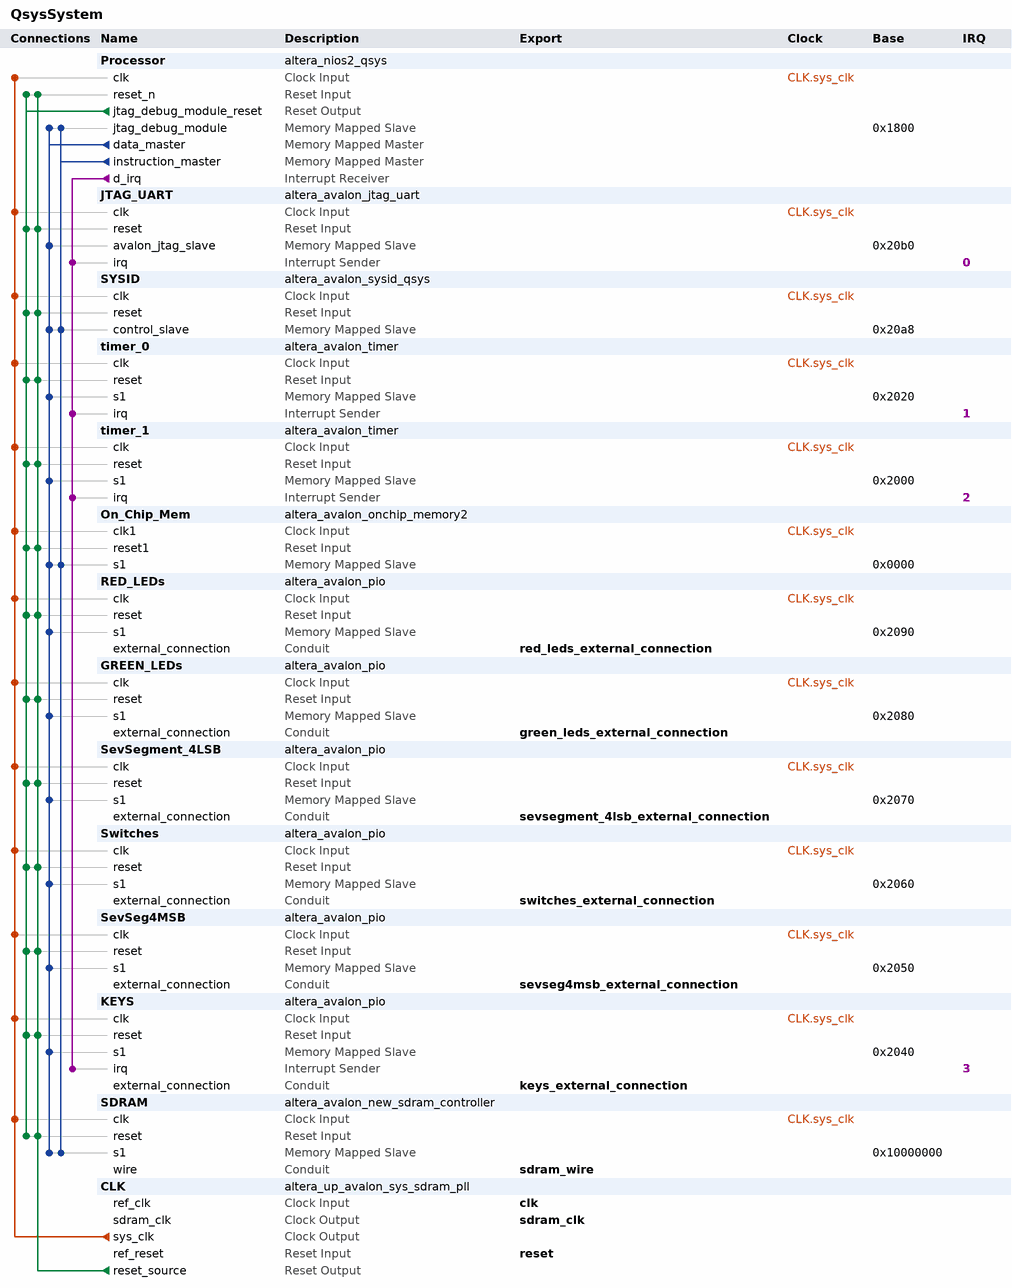
[diagram p0: system contents]
# Platform Designer (Qsys) system QsysSystem, Cyclone IV E EP4CE115F29C7
# Parameters at their usual value, and those the tool derives, are not listed.
package require -exact qsys 16.1
create_system QsysSystem
set_project_property DEVICE_FAMILY {Cyclone IV E}
set_project_property DEVICE EP4CE115F29C7

add_instance Processor altera_nios2_qsys 16.1
set_instance_parameter_value Processor breakSlave Processor.jtag_debug_module
set_instance_parameter_value Processor exceptionSlave SDRAM.s1
set_instance_parameter_value Processor icache_size 4096
set_instance_parameter_value Processor impl Fast
set_instance_parameter_value Processor mmu_TLBMissExcSlave None
set_instance_parameter_value Processor resetSlave SDRAM.s1
set_instance_parameter_value Processor resetrequest_enabled true

add_instance JTAG_UART altera_avalon_jtag_uart 16.1
set_instance_parameter_value JTAG_UART simInteractiveOptions NO_INTERACTIVE_WINDOWS

add_instance SYSID altera_avalon_sysid_qsys 16.1
set_instance_parameter_value SYSID id 0

add_instance timer_0 altera_avalon_timer 16.1
set_instance_parameter_value timer_0 period 1
set_instance_parameter_value timer_0 periodUnits MSEC

add_instance timer_1 altera_avalon_timer 16.1
set_instance_parameter_value timer_1 period 1
set_instance_parameter_value timer_1 periodUnits MSEC

add_instance On_Chip_Mem altera_avalon_onchip_memory2 16.1
set_instance_parameter_value On_Chip_Mem dataWidth 32
set_instance_parameter_value On_Chip_Mem dualPort false
set_instance_parameter_value On_Chip_Mem initMemContent true
set_instance_parameter_value On_Chip_Mem initializationFileName onchip_mem.hex
set_instance_parameter_value On_Chip_Mem memorySize 4096

add_instance RED_LEDs altera_avalon_pio 16.1
set_instance_parameter_value RED_LEDs direction Output
set_instance_parameter_value RED_LEDs width 18

add_instance GREEN_LEDs altera_avalon_pio 16.1
set_instance_parameter_value GREEN_LEDs direction Output
set_instance_parameter_value GREEN_LEDs width 8

add_instance SevSegment_4LSB altera_avalon_pio 16.1
set_instance_parameter_value SevSegment_4LSB direction Output
set_instance_parameter_value SevSegment_4LSB width 32

add_instance Switches altera_avalon_pio 16.1
set_instance_parameter_value Switches direction Input
set_instance_parameter_value Switches width 18

add_instance SevSeg4MSB altera_avalon_pio 16.1
set_instance_parameter_value SevSeg4MSB direction Output
set_instance_parameter_value SevSeg4MSB width 32

add_instance KEYS altera_avalon_pio 16.1
set_instance_parameter_value KEYS captureEdge true
set_instance_parameter_value KEYS direction Input
set_instance_parameter_value KEYS generateIRQ true
set_instance_parameter_value KEYS irqType EDGE
set_instance_parameter_value KEYS width 4

add_instance SDRAM altera_avalon_new_sdram_controller 16.1
set_instance_parameter_value SDRAM TAC 5.4
set_instance_parameter_value SDRAM TRCD 15.0
set_instance_parameter_value SDRAM TRP 15.0
set_instance_parameter_value SDRAM casLatency 3
set_instance_parameter_value SDRAM columnWidth 10
set_instance_parameter_value SDRAM dataWidth 32
set_instance_parameter_value SDRAM generateSimulationModel false
set_instance_parameter_value SDRAM model single_Micron_MT48LC4M32B2_7_chip
set_instance_parameter_value SDRAM numberOfBanks 4
set_instance_parameter_value SDRAM numberOfChipSelects 1
set_instance_parameter_value SDRAM powerUpDelay 100.0
set_instance_parameter_value SDRAM refreshPeriod 7.8125
set_instance_parameter_value SDRAM rowWidth 13

add_instance CLK altera_up_avalon_sys_sdram_pll 16.1
set_instance_parameter_value CLK CV_boards DE1-SoC
set_instance_parameter_value CLK gui_outclk 50.0
set_instance_parameter_value CLK gui_refclk 50.0

# connections
add_connection CLK.sys_clk GREEN_LEDs.clk clock
add_connection CLK.sys_clk JTAG_UART.clk clock
add_connection CLK.sys_clk KEYS.clk clock
add_connection CLK.sys_clk On_Chip_Mem.clk1 clock
add_connection CLK.sys_clk Processor.clk clock
add_connection CLK.sys_clk RED_LEDs.clk clock
add_connection CLK.sys_clk SDRAM.clk clock
add_connection CLK.sys_clk SevSeg4MSB.clk clock
add_connection CLK.sys_clk SevSegment_4LSB.clk clock
add_connection CLK.sys_clk Switches.clk clock
add_connection CLK.sys_clk SYSID.clk clock
add_connection CLK.sys_clk timer_0.clk clock
add_connection CLK.sys_clk timer_1.clk clock
add_connection CLK.reset_source GREEN_LEDs.reset reset
add_connection CLK.reset_source JTAG_UART.reset reset
add_connection CLK.reset_source KEYS.reset reset
add_connection CLK.reset_source On_Chip_Mem.reset1 reset
add_connection CLK.reset_source Processor.reset_n reset
add_connection CLK.reset_source RED_LEDs.reset reset
add_connection CLK.reset_source SDRAM.reset reset
add_connection CLK.reset_source SevSeg4MSB.reset reset
add_connection CLK.reset_source SevSegment_4LSB.reset reset
add_connection CLK.reset_source Switches.reset reset
add_connection CLK.reset_source SYSID.reset reset
add_connection CLK.reset_source timer_0.reset reset
add_connection CLK.reset_source timer_1.reset reset
add_connection Processor.jtag_debug_module_reset GREEN_LEDs.reset reset
add_connection Processor.jtag_debug_module_reset JTAG_UART.reset reset
add_connection Processor.jtag_debug_module_reset KEYS.reset reset
add_connection Processor.jtag_debug_module_reset On_Chip_Mem.reset1 reset
add_connection Processor.jtag_debug_module_reset Processor.reset_n reset
add_connection Processor.jtag_debug_module_reset RED_LEDs.reset reset
add_connection Processor.jtag_debug_module_reset SDRAM.reset reset
add_connection Processor.jtag_debug_module_reset SevSeg4MSB.reset reset
add_connection Processor.jtag_debug_module_reset SevSegment_4LSB.reset reset
add_connection Processor.jtag_debug_module_reset Switches.reset reset
add_connection Processor.jtag_debug_module_reset SYSID.reset reset
add_connection Processor.jtag_debug_module_reset timer_0.reset reset
add_connection Processor.jtag_debug_module_reset timer_1.reset reset
add_connection Processor.data_master GREEN_LEDs.s1 avalon
set_connection_parameter_value Processor.data_master/GREEN_LEDs.s1 baseAddress 0x2080
add_connection Processor.data_master JTAG_UART.avalon_jtag_slave avalon
set_connection_parameter_value Processor.data_master/JTAG_UART.avalon_jtag_slave baseAddress 0x20b0
add_connection Processor.data_master KEYS.s1 avalon
set_connection_parameter_value Processor.data_master/KEYS.s1 baseAddress 0x2040
add_connection Processor.data_master On_Chip_Mem.s1 avalon
set_connection_parameter_value Processor.data_master/On_Chip_Mem.s1 baseAddress 0x0000
add_connection Processor.data_master Processor.jtag_debug_module avalon
set_connection_parameter_value Processor.data_master/Processor.jtag_debug_module baseAddress 0x1800
add_connection Processor.data_master RED_LEDs.s1 avalon
set_connection_parameter_value Processor.data_master/RED_LEDs.s1 baseAddress 0x2090
add_connection Processor.data_master SDRAM.s1 avalon
set_connection_parameter_value Processor.data_master/SDRAM.s1 baseAddress 0x10000000
add_connection Processor.data_master SevSeg4MSB.s1 avalon
set_connection_parameter_value Processor.data_master/SevSeg4MSB.s1 baseAddress 0x2050
add_connection Processor.data_master SevSegment_4LSB.s1 avalon
set_connection_parameter_value Processor.data_master/SevSegment_4LSB.s1 baseAddress 0x2070
add_connection Processor.data_master Switches.s1 avalon
set_connection_parameter_value Processor.data_master/Switches.s1 baseAddress 0x2060
add_connection Processor.data_master SYSID.control_slave avalon
set_connection_parameter_value Processor.data_master/SYSID.control_slave baseAddress 0x20a8
add_connection Processor.data_master timer_0.s1 avalon
set_connection_parameter_value Processor.data_master/timer_0.s1 baseAddress 0x2020
add_connection Processor.data_master timer_1.s1 avalon
set_connection_parameter_value Processor.data_master/timer_1.s1 baseAddress 0x2000
add_connection Processor.instruction_master On_Chip_Mem.s1 avalon
set_connection_parameter_value Processor.instruction_master/On_Chip_Mem.s1 baseAddress 0x0000
add_connection Processor.instruction_master Processor.jtag_debug_module avalon
set_connection_parameter_value Processor.instruction_master/Processor.jtag_debug_module baseAddress 0x1800
add_connection Processor.instruction_master SDRAM.s1 avalon
set_connection_parameter_value Processor.instruction_master/SDRAM.s1 baseAddress 0x10000000
add_connection Processor.instruction_master SYSID.control_slave avalon
set_connection_parameter_value Processor.instruction_master/SYSID.control_slave baseAddress 0x20a8
add_connection Processor.d_irq JTAG_UART.irq interrupt
set_connection_parameter_value Processor.d_irq/JTAG_UART.irq irqNumber 0
add_connection Processor.d_irq KEYS.irq interrupt
set_connection_parameter_value Processor.d_irq/KEYS.irq irqNumber 3
add_connection Processor.d_irq timer_0.irq interrupt
set_connection_parameter_value Processor.d_irq/timer_0.irq irqNumber 1
add_connection Processor.d_irq timer_1.irq interrupt
set_connection_parameter_value Processor.d_irq/timer_1.irq irqNumber 2

# exported interfaces
add_interface clk clock sink
set_interface_property clk EXPORT_OF CLK.ref_clk
add_interface green_leds_external_connection conduit end
set_interface_property green_leds_external_connection EXPORT_OF GREEN_LEDs.external_connection
add_interface keys_external_connection conduit end
set_interface_property keys_external_connection EXPORT_OF KEYS.external_connection
add_interface red_leds_external_connection conduit end
set_interface_property red_leds_external_connection EXPORT_OF RED_LEDs.external_connection
add_interface reset reset sink
set_interface_property reset EXPORT_OF CLK.ref_reset
add_interface sdram_clk clock source
set_interface_property sdram_clk EXPORT_OF CLK.sdram_clk
add_interface sdram_wire conduit end
set_interface_property sdram_wire EXPORT_OF SDRAM.wire
add_interface sevseg4msb_external_connection conduit end
set_interface_property sevseg4msb_external_connection EXPORT_OF SevSeg4MSB.external_connection
add_interface sevsegment_4lsb_external_connection conduit end
set_interface_property sevsegment_4lsb_external_connection EXPORT_OF SevSegment_4LSB.external_connection
add_interface switches_external_connection conduit end
set_interface_property switches_external_connection EXPORT_OF Switches.external_connection

set_interconnect_requirement {$system} qsys_mm.clockCrossingAdapter HANDSHAKE
set_interconnect_requirement {$system} qsys_mm.enableEccProtection FALSE
set_interconnect_requirement {$system} qsys_mm.insertDefaultSlave FALSE
set_interconnect_requirement {$system} qsys_mm.maxAdditionalLatency 1

save_system QsysSystem.qsys
